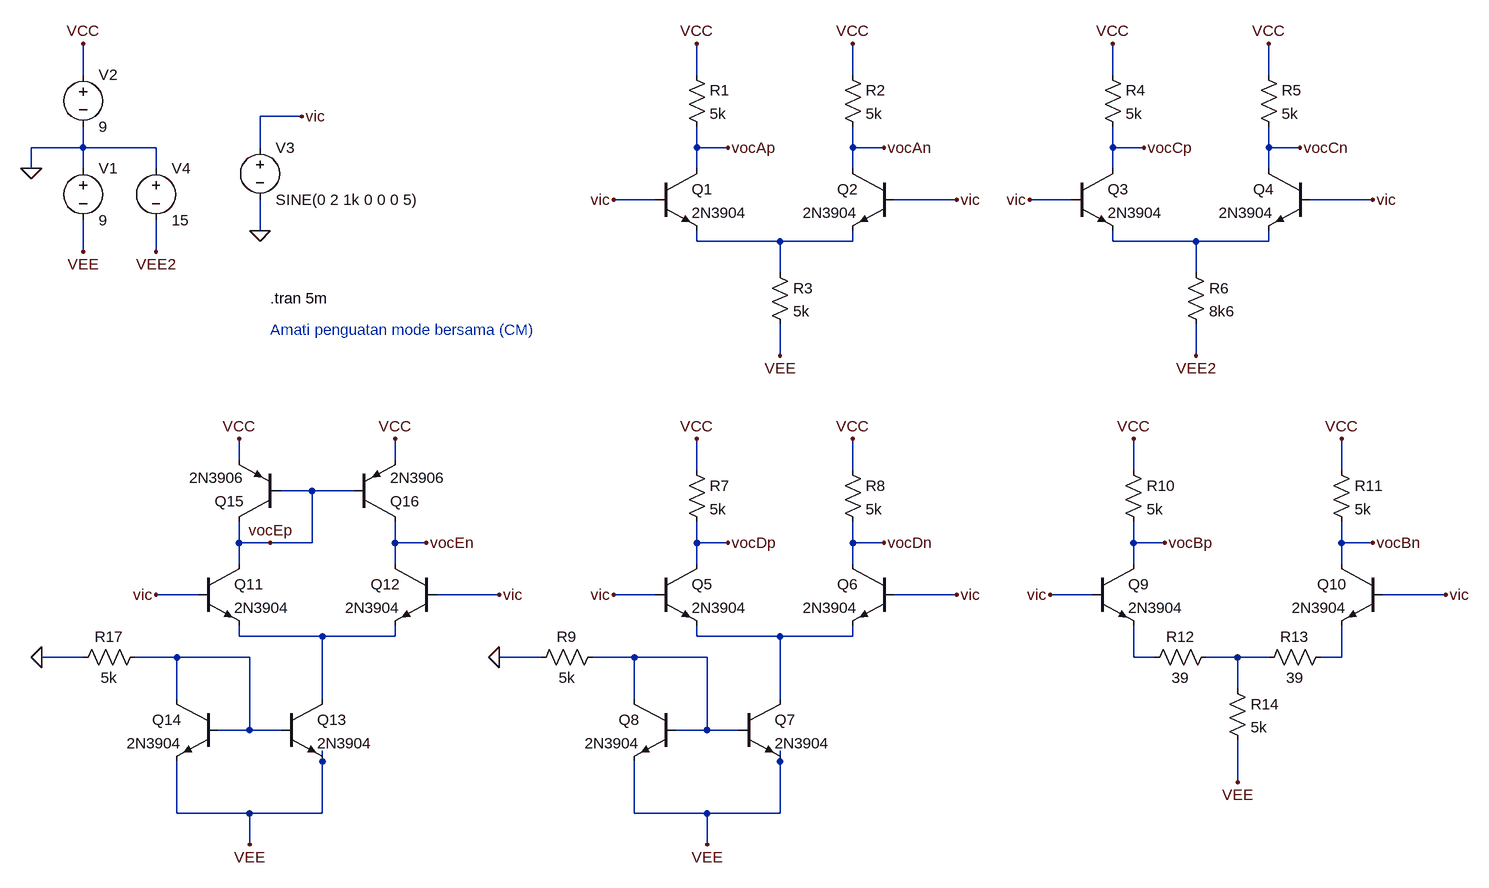
[diagram p0: schematic Perc-01-commonmode.asc]
Perc-01-commonmode.asc, the LTspice schematic file:
Version 4
SHEET 1 1712 1240
WIRE -544 -32 -544 -80
WIRE 400 -32 400 -80
WIRE 640 -32 640 -80
WIRE 1040 -32 1040 -80
WIRE 1280 -32 1280 -80
WIRE -208 32 -272 32
WIRE -544 80 -544 48
WIRE -544 80 -624 80
WIRE -432 80 -544 80
WIRE -272 80 -272 32
WIRE 400 80 400 48
WIRE 448 80 400 80
WIRE 640 80 640 48
WIRE 688 80 640 80
WIRE 1040 80 1040 48
WIRE 1088 80 1040 80
WIRE 1280 80 1280 48
WIRE 1328 80 1280 80
WIRE -624 112 -624 80
WIRE -544 112 -544 80
WIRE -432 112 -432 80
WIRE 400 112 400 80
WIRE 640 112 640 80
WIRE 1040 112 1040 80
WIRE 1280 112 1280 80
WIRE 336 160 272 160
WIRE 800 160 704 160
WIRE 976 160 912 160
WIRE 1440 160 1344 160
WIRE -272 208 -272 160
WIRE 400 224 400 208
WIRE 528 224 400 224
WIRE 640 224 640 208
WIRE 640 224 528 224
WIRE 1040 224 1040 208
WIRE 1168 224 1040 224
WIRE 1280 224 1280 208
WIRE 1280 224 1168 224
WIRE -544 240 -544 192
WIRE -432 240 -432 192
WIRE 528 272 528 224
WIRE 1168 272 1168 224
WIRE 528 400 528 352
WIRE 1168 400 1168 352
WIRE -304 560 -304 528
WIRE -64 560 -64 528
WIRE 400 576 400 528
WIRE 640 576 640 528
WIRE 1072 576 1072 528
WIRE 1392 576 1392 528
WIRE -192 608 -240 608
WIRE -128 608 -192 608
WIRE -304 688 -304 656
WIRE -256 688 -304 688
WIRE -192 688 -192 608
WIRE -192 688 -256 688
WIRE -64 688 -64 656
WIRE -16 688 -64 688
WIRE 400 688 400 656
WIRE 448 688 400 688
WIRE 640 688 640 656
WIRE 688 688 640 688
WIRE 1072 688 1072 656
WIRE 1120 688 1072 688
WIRE 1392 688 1392 656
WIRE 1440 688 1392 688
WIRE -304 720 -304 688
WIRE -64 720 -64 688
WIRE 400 720 400 688
WIRE 640 720 640 688
WIRE 1072 720 1072 688
WIRE 1392 720 1392 688
WIRE -368 768 -432 768
WIRE 96 768 0 768
WIRE 336 768 272 768
WIRE 800 768 704 768
WIRE 1008 768 944 768
WIRE 1552 768 1456 768
WIRE -304 832 -304 816
WIRE -176 832 -304 832
WIRE -64 832 -64 816
WIRE -64 832 -176 832
WIRE 400 832 400 816
WIRE 528 832 400 832
WIRE 640 832 640 816
WIRE 640 832 528 832
WIRE -544 864 -608 864
WIRE -400 864 -464 864
WIRE -288 864 -400 864
WIRE 160 864 96 864
WIRE 304 864 240 864
WIRE 416 864 304 864
WIRE 1072 864 1072 816
WIRE 1104 864 1072 864
WIRE 1232 864 1184 864
WIRE 1280 864 1232 864
WIRE 1392 864 1392 816
WIRE 1392 864 1360 864
WIRE 1232 912 1232 864
WIRE -400 928 -400 864
WIRE -176 928 -176 832
WIRE 304 928 304 864
WIRE 528 928 528 832
WIRE -288 976 -288 864
WIRE -288 976 -336 976
WIRE -240 976 -288 976
WIRE 416 976 416 864
WIRE 416 976 368 976
WIRE 464 976 416 976
WIRE -176 1024 -176 1008
WIRE 528 1024 528 1008
WIRE 1232 1056 1232 992
WIRE -400 1104 -400 1024
WIRE -288 1104 -400 1104
WIRE -176 1104 -176 1024
WIRE -176 1104 -288 1104
WIRE 304 1104 304 1024
WIRE 416 1104 304 1104
WIRE 528 1104 528 1024
WIRE 528 1104 416 1104
WIRE -288 1152 -288 1104
WIRE 416 1152 416 1104
FLAG 400 -80 VCC
FLAG 640 -80 VCC
FLAG 528 400 VEE
FLAG 448 80 vocAp
FLAG 688 80 vocAn
FLAG -544 -80 VCC
FLAG -544 240 VEE
FLAG -624 112 0
FLAG -272 208 0
FLAG -208 32 vic
FLAG 272 160 vic
FLAG 800 160 vic
FLAG -432 240 VEE2
FLAG 1040 -80 VCC
FLAG 1280 -80 VCC
FLAG 1168 400 VEE2
FLAG 1088 80 vocCp
FLAG 1328 80 vocCn
FLAG 912 160 vic
FLAG 1440 160 vic
FLAG 400 528 VCC
FLAG 640 528 VCC
FLAG 448 688 vocDp
FLAG 688 688 vocDn
FLAG 272 768 vic
FLAG 800 768 vic
FLAG 416 1152 VEE
FLAG 1072 528 VCC
FLAG 1392 528 VCC
FLAG 1120 688 vocBp
FLAG 1440 688 vocBn
FLAG 944 768 vic
FLAG 1552 768 vic
FLAG 1232 1056 VEE
FLAG 96 864 0
FLAG -304 528 VCC
FLAG -64 528 VCC
FLAG -256 688 vocEp
FLAG -16 688 vocEn
FLAG -432 768 vic
FLAG 96 768 vic
FLAG -288 1152 VEE
FLAG -608 864 0
SYMBOL npn 336 112 R0
SYMATTR InstName Q1
SYMATTR Value 2N3904
SYMBOL npn 704 112 M0
SYMATTR InstName Q2
SYMATTR Value 2N3904
SYMBOL res 384 -48 R0
SYMATTR InstName R1
SYMATTR Value 5k
SYMBOL res 624 -48 R0
SYMATTR InstName R2
SYMATTR Value 5k
SYMBOL res 512 256 R0
SYMATTR InstName R3
SYMATTR Value 5k
SYMBOL voltage -544 96 R0
WINDOW 123 0 0 Left 0
WINDOW 39 0 0 Left 0
SYMATTR InstName V1
SYMATTR Value 9
SYMBOL voltage -544 -48 R0
WINDOW 123 0 0 Left 0
WINDOW 39 0 0 Left 0
SYMATTR InstName V2
SYMATTR Value 9
SYMBOL voltage -272 64 R0
WINDOW 123 0 0 Left 0
WINDOW 39 0 0 Left 0
SYMATTR InstName V3
SYMATTR Value SINE(0 2 1k 0 0 0 5)
SYMBOL voltage -432 96 R0
WINDOW 123 0 0 Left 0
WINDOW 39 0 0 Left 0
SYMATTR InstName V4
SYMATTR Value 15
SYMBOL npn 976 112 R0
SYMATTR InstName Q3
SYMATTR Value 2N3904
SYMBOL npn 1344 112 M0
SYMATTR InstName Q4
SYMATTR Value 2N3904
SYMBOL res 1024 -48 R0
SYMATTR InstName R4
SYMATTR Value 5k
SYMBOL res 1264 -48 R0
SYMATTR InstName R5
SYMATTR Value 5k
SYMBOL res 1152 256 R0
SYMATTR InstName R6
SYMATTR Value 8k6
SYMBOL npn 336 720 R0
SYMATTR InstName Q5
SYMATTR Value 2N3904
SYMBOL npn 704 720 M0
SYMATTR InstName Q6
SYMATTR Value 2N3904
SYMBOL res 384 560 R0
SYMATTR InstName R7
SYMATTR Value 5k
SYMBOL res 624 560 R0
SYMATTR InstName R8
SYMATTR Value 5k
SYMBOL npn 464 928 R0
SYMATTR InstName Q7
SYMATTR Value 2N3904
SYMBOL npn 368 928 M0
SYMATTR InstName Q8
SYMATTR Value 2N3904
SYMBOL res 256 848 R90
WINDOW 0 0 56 VBottom 2
WINDOW 3 32 56 VTop 2
SYMATTR InstName R9
SYMATTR Value 5k
SYMBOL npn 1008 720 R0
SYMATTR InstName Q9
SYMATTR Value 2N3904
SYMBOL npn 1456 720 M0
SYMATTR InstName Q10
SYMATTR Value 2N3904
SYMBOL res 1056 560 R0
SYMATTR InstName R10
SYMATTR Value 5k
SYMBOL res 1376 560 R0
SYMATTR InstName R11
SYMATTR Value 5k
SYMBOL res 1376 848 R90
WINDOW 0 0 56 VBottom 2
WINDOW 3 32 56 VTop 2
SYMATTR InstName R13
SYMATTR Value 39
SYMBOL res 1200 848 R90
WINDOW 0 0 56 VBottom 2
WINDOW 3 32 56 VTop 2
SYMATTR InstName R12
SYMATTR Value 39
SYMBOL res 1216 896 R0
SYMATTR InstName R14
SYMATTR Value 5k
SYMBOL npn -368 720 R0
SYMATTR InstName Q11
SYMATTR Value 2N3904
SYMBOL npn 0 720 M0
SYMATTR InstName Q12
SYMATTR Value 2N3904
SYMBOL npn -240 928 R0
SYMATTR InstName Q13
SYMATTR Value 2N3904
SYMBOL npn -336 928 M0
SYMATTR InstName Q14
SYMATTR Value 2N3904
SYMBOL res -448 848 R90
WINDOW 0 0 56 VBottom 2
WINDOW 3 32 56 VTop 2
SYMATTR InstName R17
SYMATTR Value 5k
SYMBOL pnp -240 656 R180
SYMATTR InstName Q15
SYMATTR Value 2N3906
SYMBOL pnp -128 656 M180
SYMATTR InstName Q16
SYMATTR Value 2N3906
TEXT -256 312 Left 2 !.tran 5m
TEXT -256 360 Left 2 ;Amati penguatan mode bersama (CM)

The netlist it stands for:
* Perc-01-commonmode.asc
Q1 vocAp vic N001 0 2N3904
Q2 vocAn vic N001 0 2N3904
R1 VCC vocAp 5k
R2 VCC vocAn 5k
R3 N001 VEE 5k
V1 0 VEE 9
V2 VCC 0 9
V3 vic 0 SINE(0 2 1k 0 0 0 5)
V4 0 VEE2 15
Q3 vocCp vic N002 0 2N3904
Q4 vocCn vic N002 0 2N3904
R4 VCC vocCp 5k
R5 VCC vocCn 5k
R6 N002 VEE2 8k6
Q5 vocDp vic N004 0 2N3904
Q6 vocDn vic N004 0 2N3904
R7 VCC vocDp 5k
R8 VCC vocDn 5k
Q7 N004 N006 VEE 0 2N3904
Q8 N006 N006 VEE 0 2N3904
R9 N006 0 5k
Q9 vocBp vic N007 0 2N3904
Q10 vocBn vic N009 0 2N3904
R10 VCC vocBp 5k
R11 VCC vocBn 5k
R13 N009 N008 39
R12 N008 N007 39
R14 N008 VEE 5k
Q11 vocEp vic N003 0 2N3904
Q12 vocEn vic N003 0 2N3904
Q13 N003 N005 VEE 0 2N3904
Q14 N005 N005 VEE 0 2N3904
R17 N005 0 5k
Q15 vocEp vocEp VCC 0 2N3906
Q16 vocEn vocEp VCC 0 2N3906
.model NPN NPN
.model PNP PNP
.lib standard.bjt
.tran 5m
* Amati penguatan mode bersama (CM)
.backanno
.end